# EasyEDA schematic plan B syntheseproject.json
TITLE: Elektrisch schema plan B; REV: 1.0; Date: 2022-10-14; Sheet: 1/1; Company: HOGENT
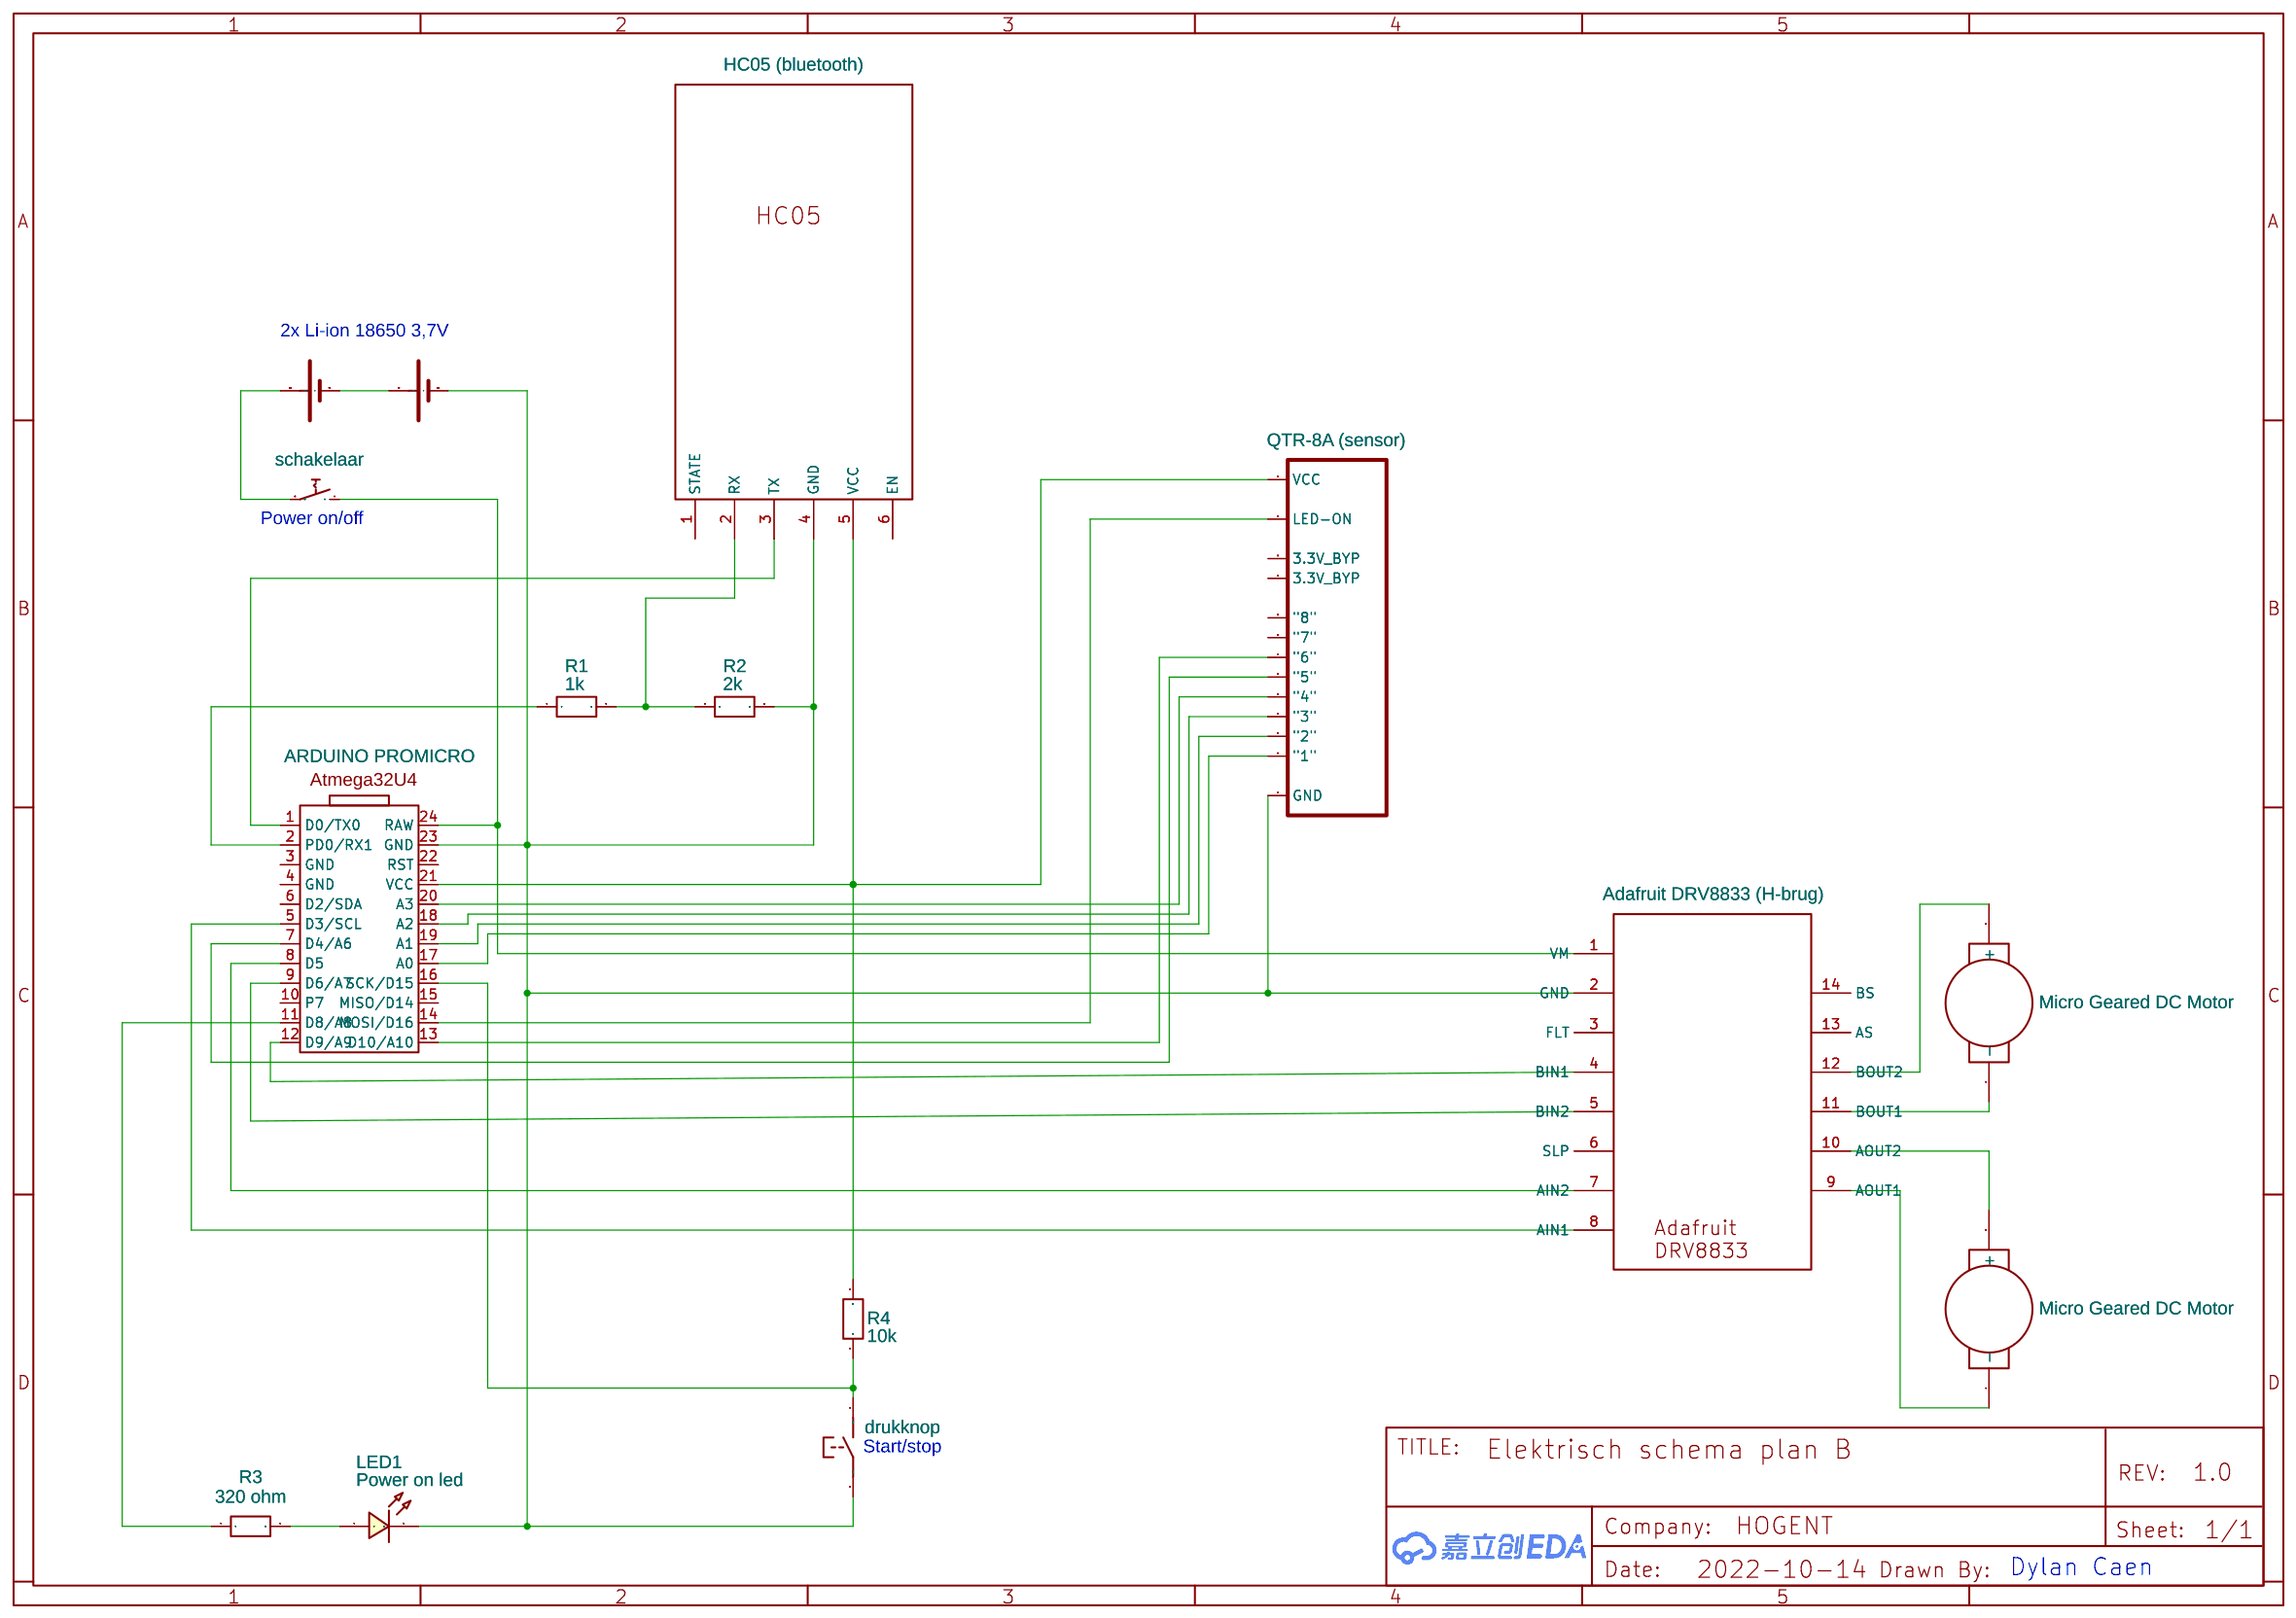
[diagram p0: schematic sheet]

## Parts
BAT1  BATTERY  [BATTERY-AAA]
BAT2  BATTERY  [BATTERY-AAA]
LED1  Power on led  [LED0603_RED]
R1  1k  [R0603]
R2  2k  [R0603]
R3  320 ohm  [R0603]
R4  10k  [R0603]
U1  ARDUINO PROMICRO  [ARDUINOPROMICRO]
U2  HC05 (bluetooth)  [HC05]
U3  Adafruit DRV8833 (H-brug)  [ADAFRUIT DRV8833]
U4  QTR-8A (sensor)  [QTR-8A/8RC]
U5  Micro Geared DC Motor  [MICRO GEARED DC MOTOR PADS]
U6  Micro Geared DC Motor  [MICRO GEARED DC MOTOR PADS]
U8  schakelaar
U9  drukknop

## Library data of the parts
BAT1 BAT2 = BATTERY: Contributor: SparkFun; sourceId: 2mVTtPN96
LED1 = LED-0603_R: Manufacturer: EVERLIGHT(台湾亿光); Manufacturer Part: 19-217/R6C-AL1M2VY/3T; Supplier Part: C72044; Supplier: LCSC; Contributor: LCEDA_01
R1-R4 = R_0603_EU: Contributor: LCEDA_Lib
U1 = ARDUINO PROMICRO: Contributor: b.kalmukov
U2 = HC05: Contributor: emanuelturtula
U3 = Adafruit DRV8833 _Test: Manufacturer Part: Adafruit; link: https://www.adafruit.com/product/3297; Contributor: Lars Bretthauer
U4 = QTR-8A: Manufacturer: Pololu; Supplier: Pololu; Supplier Part: 960; link: https://www.pololu.com/docs/pdf/0J12/QTR-8x.pdf; Contributor: Junikos
U5 U6 = Micro Geared DC Motor: link: https://www.amazon.com/dp/B07N7PY71F?psc=1&ref=ppx_yo2ov_dt_b_product_details; Contributor: Guest
U8 = schakelaar: Contributor: onschacline
U9 = drukknop: Contributor: bobette273

## Nets
Net-(BAT1-GND@1): BAT1.GND@1(-) BAT2.PWR@1(+)
Net-(BAT1-PWR@1): BAT1.PWR@1(+) U8.2
Net-(BAT2-GND@1): BAT2.GND@1(-) LED1.2 R2.2 U1.23(GND) U2.4(GND) U4.1(GND) U9.2
Net-(LED1-1): LED1.1 R3.2
Net-(R1-1): R1.1 U1.2(PD0/RX1)
Net-(R1-2): R1.2 R2.1 U2.2(RX)
Net-(R3-1): R3.1 U1.11(D8/A8)
Net-(R4-1): R4.1 U1.16(SCK/D15) U9.1
Net-(R4-2): R4.2 U1.14(MOSI/D16) U1.21(VCC) U2.5(VCC) U4.12(LED-ON)
Net-(U1-1): U1.1(D0/TX0) U2.3(TX)
Net-(U1-7): U1.7(D4/A6) U4.6("5")
Net-(U1-13): U1.13(D10/A10) U4.7("6")
Net-(U1-17): U1.17(A0) U4.2("1")
Net-(U1-18): U1.18(A2) U4.4("3")
Net-(U1-19): U1.19(A1) U4.3("2")
Net-(U1-20): U1.20(A3) U4.5("4")
Net-(U1-24): U1.24(RAW) U8.1

Not connected (* = marked no-connect by the designer): U1 3(GND) 4(GND) 5(D3/SCL) 6(D2/SDA) 8(D5) 9(D6/A7) 10(P7) 12(D9/A9) 15(MISO/D14) 22(RST); U2 1(STATE) 6(EN); U3 1(VM) 2(GND) 3(FLT) 4(BIN1) 5(BIN2) 6(SLP) 7(AIN2) 8(AIN1) 9(AOUT1) 10(AOUT2) 11(BOUT1) 12(BOUT2) 13(AS) 14(BS); U4 8("7") 9("8") 10(3.3V BYP) 11(3.3V BYP); U5 1(-) 2(+); U6 1(-) 2(+)

## Notes on the sheet
- 2x Li-ion 18650 3,7V
- Power on/off
- Start/stop
- Dylan Caen
